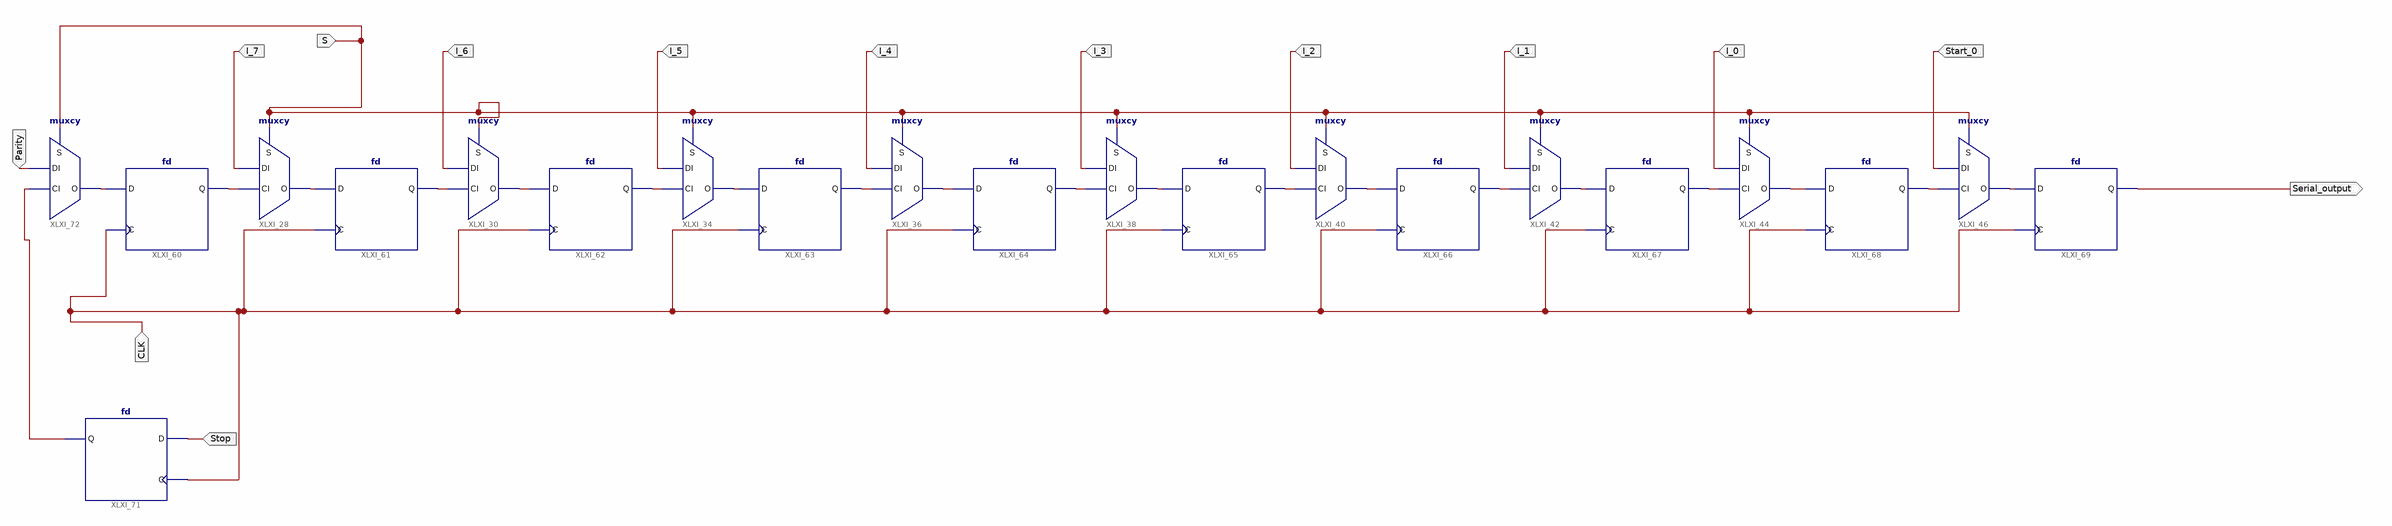
[diagram p0: schematic sheet 1]
// Xilinx ISE schematic bit10datareg_to_transmit.sch (spartan3e) as structural Verilog: 21 symbols, 14 ports
module bit10datareg_to_transmit (
  input  I_7,
  input  I_6,
  input  I_5,
  input  I_4,
  input  I_3,
  input  I_2,
  input  I_1,
  input  I_0,
  input  Start_0,
  input  S,
  input  CLK,
  input  Stop,
  input  Parity,
  output Serial_output
);

  wire XLXN_70, XLXN_72, XLXN_80, XLXN_81, XLXN_83, XLXN_85, XLXN_86, XLXN_87, XLXN_89, XLXN_91, XLXN_92,
       XLXN_94, XLXN_96, XLXN_97, XLXN_98, XLXN_99, XLXN_103, XLXN_120, XLXN_137, XLXN_153;

  muxcy XLXI_28 (.CI(XLXN_70), .DI(I_7), .S(S), .O(XLXN_80));
  muxcy XLXI_30 (.CI(XLXN_72), .DI(I_6), .S(S), .O(XLXN_86));
  muxcy XLXI_34 (.CI(XLXN_81), .DI(I_5), .S(S), .O(XLXN_85));
  muxcy XLXI_36 (.CI(XLXN_83), .DI(I_4), .S(S), .O(XLXN_98));
  muxcy XLXI_38 (.CI(XLXN_87), .DI(I_3), .S(S), .O(XLXN_91));
  muxcy XLXI_40 (.CI(XLXN_89), .DI(I_2), .S(S), .O(XLXN_97));
  muxcy XLXI_42 (.CI(XLXN_92), .DI(I_1), .S(S), .O(XLXN_96));
  muxcy XLXI_44 (.CI(XLXN_94), .DI(I_0), .S(S), .O(XLXN_120));
  muxcy XLXI_46 (.CI(XLXN_99), .DI(Start_0), .S(S), .O(XLXN_103));
  fd XLXI_60 (.C(CLK), .D(XLXN_137), .Q(XLXN_70));
  fd XLXI_61 (.C(CLK), .D(XLXN_80), .Q(XLXN_72));
  fd XLXI_62 (.C(CLK), .D(XLXN_86), .Q(XLXN_81));
  fd XLXI_63 (.C(CLK), .D(XLXN_85), .Q(XLXN_83));
  fd XLXI_64 (.C(CLK), .D(XLXN_98), .Q(XLXN_87));
  fd XLXI_65 (.C(CLK), .D(XLXN_91), .Q(XLXN_89));
  fd XLXI_66 (.C(CLK), .D(XLXN_97), .Q(XLXN_92));
  fd XLXI_67 (.C(CLK), .D(XLXN_96), .Q(XLXN_94));
  fd XLXI_68 (.C(CLK), .D(XLXN_120), .Q(XLXN_99));
  muxcy XLXI_72 (.CI(XLXN_153), .DI(Parity), .S(S), .O(XLXN_137));
  fd XLXI_71 (.C(CLK), .D(Stop), .Q(XLXN_153));
  fd XLXI_69 (.C(CLK), .D(XLXN_103), .Q(Serial_output));
endmodule
